# Altium project DHS.PrjPcb
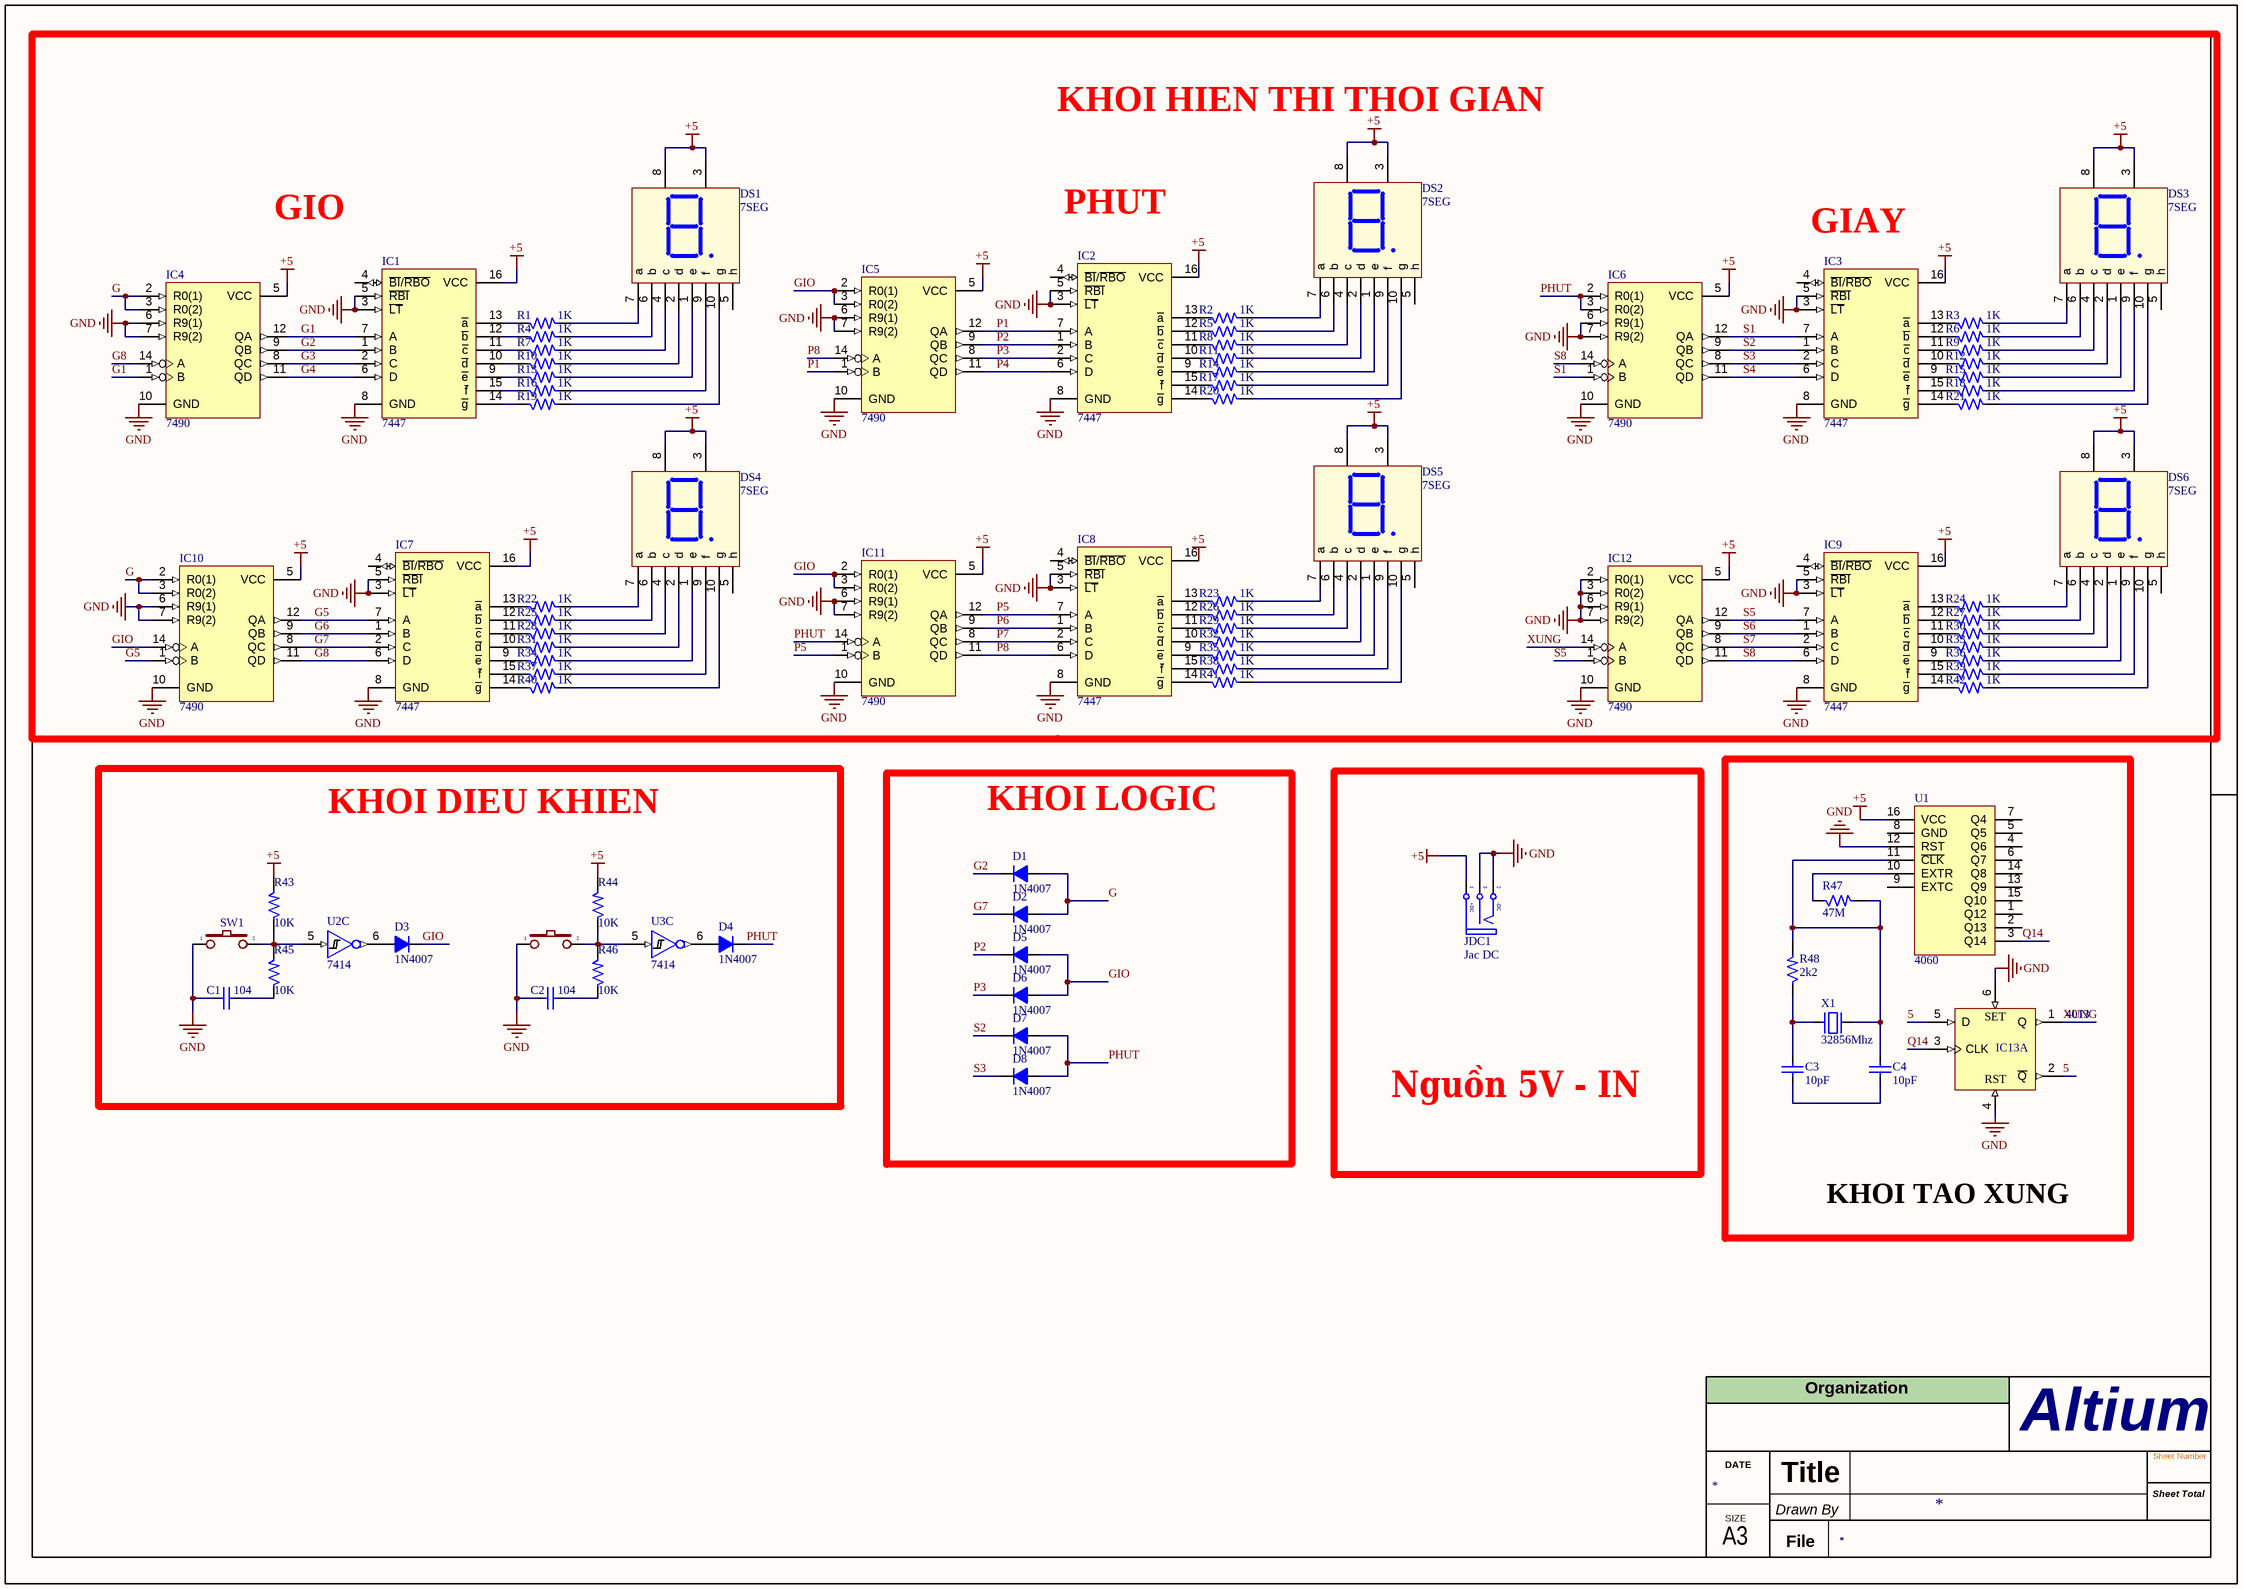
[diagram p0: DHS.SchDoc]
1 sheet, 86 parts. Net scope: global (net labels, ports and power ports of the same name join across sheets).
Board file: PCB1.PcbDoc

## Sheet DHS.SchDoc
size 420 x 297 mm; SheetNumber: 1; SheetTotal: 1

### Parts
C1  104  [Cap 2.54mm]
C2  104  [Cap 2.54mm]
C3  10pF  [Cap 7.5mm]
C4  10pF  [Cap 7.5mm]
D1  1N4007  [D2A]
D2  1N4007  [D2A]
D3  1N4007  [DO-41]
D4  1N4007  [DO-41]
D5  1N4007  [D2A]
D6  1N4007  [D2A]
D7  1N4007  [D2A]
D8  1N4007  [D2A]
DS1  7SEG  [LED7SEG-1-0.56]
DS2  7SEG  [LED7SEG-1-0.56]
DS3  7SEG  [LED7SEG-1-0.56]
DS4  7SEG  [LED7SEG-1-0.56]
DS5  7SEG  [LED7SEG-1-0.56]
DS6  7SEG  [LED7SEG-1-0.56]
IC1  7447  [DIP16]
IC2  7447  [DIP16]
IC3  7447  [DIP16]
IC4  7490  [DIP14]
IC5  7490  [DIP14]
IC6  7490  [DIP14]
IC7  7447  [DIP16]
IC8  7447  [DIP16]
IC9  7447  [DIP16]
IC10  7490  [DIP14]
IC11  7490  [DIP14]
IC12  7490  [DIP14]
IC13  4013  [DIP14]  (part A of 2)
JDC1  Jac DC  [DC0]
R1  1K  [RES-1/4W]
R2  1K  [RES-1/4W]
R3  1K  [RES-1/4W]
R4  1K  [RES-1/4W]
R5  1K  [RES-1/4W]
R6  1K  [RES-1/4W]
R7  1K  [RES-1/4W]
R8  1K  [RES-1/4W]
R9  1K  [RES-1/4W]
R10  1K  [RES-1/4W]
R11  1K  [RES-1/4W]
R12  1K  [RES-1/4W]
R13  1K  [RES-1/4W]
R14  1K  [RES-1/4W]
R15  1K  [RES-1/4W]
R16  1K  [RES-1/4W]
R17  1K  [RES-1/4W]
R18  1K  [RES-1/4W]
R19  1K  [RES-1/4W]
R20  1K  [RES-1/4W]
R21  1K  [RES-1/4W]
R22  1K  [RES-1/4W]
R23  1K  [RES-1/4W]
R24  1K  [RES-1/4W]
R25  1K  [RES-1/4W]
R26  1K  [RES-1/4W]
R27  1K  [RES-1/4W]
R28  1K  [RES-1/4W]
R29  1K  [RES-1/4W]
R30  1K  [RES-1/4W]
R31  1K  [RES-1/4W]
R32  1K  [RES-1/4W]
R33  1K  [RES-1/4W]
R34  1K  [RES-1/4W]
R35  1K  [RES-1/4W]
R36  1K  [RES-1/4W]
R37  1K  [RES-1/4W]
R38  1K  [RES-1/4W]
R39  1K  [RES-1/4W]
R40  1K  [RES-1/4W]
R41  1K  [RES-1/4W]
R42  1K  [RES-1/4W]
R43  10K  [RES-1/4W]
R44  10K  [RES-1/4W]
R45  10K  [RES-1/4W]
R46  10K  [RES-1/4W]
R47  47M  [RES-1/4W]
R48  2k2  [RES-1/4W]
SW1  SW  [SW2 6x6MM Circle]  (value not drawn)
SW2  SW  [SW2 6x6MM Circle]  (value not drawn)
U1  4060  [DIP16]
U2  7414  [DIP14]  (part C of 7)
U3  7414  [DIP14]  (part C of 7)
X1  32856Mhz  [XT2]

### Blocks framed on the sheet
Nguồn 5V - IN: JDC1
KHOI TAO XUNG: C3 C4 IC13 R47 R48 U1 X1

### Nets
+5: DS1.3(Vcc) DS1.8(Vcc) DS2.3(Vcc) DS2.8(Vcc) DS3.3(Vcc) DS3.8(Vcc) DS4.3(Vcc) DS4.8(Vcc) DS5.3(Vcc) DS5.8(Vcc) DS6.3(Vcc) DS6.8(Vcc) IC1.16(VCC) IC2.16(VCC) IC3.16(VCC) IC4.5(VCC) IC5.5(VCC) IC6.5(VCC) IC7.16(VCC) IC8.16(VCC) IC9.16(VCC) IC10.5(VCC) IC11.5(VCC) IC12.5(VCC) JDC1.1(T) R43.2 R44.2 U1.16(VCC)
GND: C1.2 C2.2 IC1.3(~{LT}) IC1.5(~{RBI}) IC1.8(GND) IC2.3(~{LT}) IC2.5(~{RBI}) IC2.8(GND) IC3.3(~{LT}) IC3.5(~{RBI}) IC3.8(GND) IC4.6(R9(1)) IC4.7(R9(2)) IC4.10(GND) IC5.6(R9(1)) IC5.7(R9(2)) IC5.10(GND) IC6.6(R9(1)) IC6.7(R9(2)) IC6.10(GND) IC7.3(~{LT}) IC7.5(~{RBI}) IC7.8(GND) IC8.3(~{LT}) IC8.5(~{RBI}) IC8.8(GND) IC9.3(~{LT}) IC9.5(~{RBI}) IC9.8(GND) IC10.6(R9(1)) IC10.7(R9(2)) IC10.10(GND) IC11.6(R9(1)) IC11.7(R9(2)) IC11.10(GND) IC12.2(R0(1)) IC12.3(R0(2)) IC12.6(R9(1)) IC12.7(R9(2)) IC12.10(GND) IC13.4(RST) IC13.6(S) IC13.7(GND) JDC1.2(TN) JDC1.3(S) SW1.1 SW2.1 U1.12(RST)
VDD: IC13.14(VDD)
5: IC13.2(~{Q}) IC13.5(D)
G: D1.1(A) D2.1(A) IC4.2(R0(1)) IC4.3(R0(2)) IC10.2(R0(1)) IC10.3(R0(2))
G1: IC1.7(A) IC4.1(B) IC4.12(QA)
G2: D1.2(K) IC1.1(B) IC4.9(QB)
G3: IC1.2(C) IC4.8(QC)
G4: IC1.6(D) IC4.11(QD)
G5: IC7.7(A) IC10.1(B) IC10.12(QA)
G6: IC7.1(B) IC10.9(QB)
G7: D2.2(K) IC7.2(C) IC10.8(QC)
G8: IC4.14(A) IC7.6(D) IC10.11(QD)
GIO: D3.2(K) D5.1(A) D6.1(A) IC5.2(R0(1)) IC5.3(R0(2)) IC10.14(A) IC11.2(R0(1)) IC11.3(R0(2))
P1: IC2.7(A) IC5.1(B) IC5.12(QA)
P2: D5.2(K) IC2.1(B) IC5.9(QB)
P3: D6.2(K) IC2.2(C) IC5.8(QC)
P4: IC2.6(D) IC5.11(QD)
P5: IC8.7(A) IC11.1(B) IC11.12(QA)
P6: IC8.1(B) IC11.9(QB)
P7: IC8.2(C) IC11.8(QC)
P8: IC5.14(A) IC8.6(D) IC11.11(QD)
PHUT: D4.2(K) D7.1(A) D8.1(A) IC6.2(R0(1)) IC6.3(R0(2)) IC11.14(A)
Q14: IC13.3(CLK) U1.3(Q14)
S1: IC3.7(A) IC6.1(B) IC6.12(QA)
S2: D7.2(K) IC3.1(B) IC6.9(QB)
S3: D8.2(K) IC3.2(C) IC6.8(QC)
S4: IC3.6(D) IC6.11(QD)
S5: IC9.7(A) IC12.1(B) IC12.12(QA)
S6: IC9.1(B) IC12.9(QB)
S7: IC9.2(C) IC12.8(QC)
S8: IC6.14(A) IC9.6(D) IC12.11(QD)
XUNG: IC12.14(A) IC13.1(Q)
NetC1_1: C1.1 R45.1
NetC2_1: C2.1 R46.1
NetC3_1: C3.1 C4.2
NetC3_2: C3.2 R48.1 X1.1
NetC4_1: C4.1 R47.2 R48.2 U1.11(~{CLK}) X1.2
NetD3_1: D3.1(A) U2.6(Y)
NetD4_1: D4.1(A) U3.6(Y)
NetDS1_1: DS1.1(e) R13.2
NetDS1_2: DS1.2(d) R10.2
NetDS1_4: DS1.4(c) R7.2
NetDS1_6: DS1.6(b) R4.2
NetDS1_7: DS1.7(a) R1.2
NetDS1_9: DS1.9(f) R16.2
NetDS1_10: DS1.10(g) R19.2
NetDS2_1: DS2.1(e) R14.2
NetDS2_2: DS2.2(d) R11.2
NetDS2_4: DS2.4(c) R8.2
NetDS2_6: DS2.6(b) R5.2
NetDS2_7: DS2.7(a) R2.2
NetDS2_9: DS2.9(f) R17.2
NetDS2_10: DS2.10(g) R20.2
NetDS3_1: DS3.1(e) R15.2
NetDS3_2: DS3.2(d) R12.2
NetDS3_4: DS3.4(c) R9.2
NetDS3_6: DS3.6(b) R6.2
NetDS3_7: DS3.7(a) R3.2
NetDS3_9: DS3.9(f) R18.2
NetDS3_10: DS3.10(g) R21.2
NetDS4_1: DS4.1(e) R34.2
NetDS4_2: DS4.2(d) R31.2
NetDS4_4: DS4.4(c) R28.2
NetDS4_6: DS4.6(b) R25.2
NetDS4_7: DS4.7(a) R22.2
NetDS4_9: DS4.9(f) R37.2
NetDS4_10: DS4.10(g) R40.2
NetDS5_1: DS5.1(e) R35.2
NetDS5_2: DS5.2(d) R32.2
NetDS5_4: DS5.4(c) R29.2
NetDS5_6: DS5.6(b) R26.2
NetDS5_7: DS5.7(a) R23.2
NetDS5_9: DS5.9(f) R38.2
NetDS5_10: DS5.10(g) R41.2
NetDS6_1: DS6.1(e) R36.2
NetDS6_2: DS6.2(d) R33.2
NetDS6_4: DS6.4(c) R30.2
NetDS6_6: DS6.6(b) R27.2
NetDS6_7: DS6.7(a) R24.2
NetDS6_9: DS6.9(f) R39.2
NetDS6_10: DS6.10(g) R42.2
NetIC1_9: IC1.9(~{e}) R13.1
NetIC1_10: IC1.10(~{d}) R10.1
NetIC1_11: IC1.11(~{c}) R7.1
NetIC1_12: IC1.12(~{b}) R4.1
NetIC1_13: IC1.13(~{a}) R1.1
NetIC1_14: IC1.14(~{g}) R19.1
NetIC1_15: IC1.15(~{f}) R16.1
NetIC2_9: IC2.9(~{e}) R14.1
NetIC2_10: IC2.10(~{d}) R11.1
NetIC2_11: IC2.11(~{c}) R8.1
NetIC2_12: IC2.12(~{b}) R5.1
NetIC2_13: IC2.13(~{a}) R2.1
NetIC2_14: IC2.14(~{g}) R20.1
NetIC2_15: IC2.15(~{f}) R17.1
NetIC3_9: IC3.9(~{e}) R15.1
NetIC3_10: IC3.10(~{d}) R12.1
NetIC3_11: IC3.11(~{c}) R9.1
NetIC3_12: IC3.12(~{b}) R6.1
NetIC3_13: IC3.13(~{a}) R3.1
NetIC3_14: IC3.14(~{g}) R21.1
NetIC3_15: IC3.15(~{f}) R18.1
NetIC7_9: IC7.9(~{e}) R34.1
NetIC7_10: IC7.10(~{d}) R31.1
NetIC7_11: IC7.11(~{c}) R28.1
NetIC7_12: IC7.12(~{b}) R25.1
NetIC7_13: IC7.13(~{a}) R22.1
NetIC7_14: IC7.14(~{g}) R40.1
NetIC7_15: IC7.15(~{f}) R37.1
NetIC8_9: IC8.9(~{e}) R35.1
NetIC8_10: IC8.10(~{d}) R32.1
NetIC8_11: IC8.11(~{c}) R29.1
NetIC8_12: IC8.12(~{b}) R26.1
NetIC8_13: IC8.13(~{a}) R23.1
NetIC8_14: IC8.14(~{g}) R41.1
NetIC8_15: IC8.15(~{f}) R38.1
NetIC9_9: IC9.9(~{e}) R36.1
NetIC9_10: IC9.10(~{d}) R33.1
NetIC9_11: IC9.11(~{c}) R30.1
NetIC9_12: IC9.12(~{b}) R27.1
NetIC9_13: IC9.13(~{a}) R24.1
NetIC9_14: IC9.14(~{g}) R42.1
NetIC9_15: IC9.15(~{f}) R39.1
NetR43_1: R43.1 R45.2 SW1.2 U2.5(A)
NetR44_1: R44.1 R46.2 SW2.2 U3.5(A)
NetR47_1: R47.1 U1.10(EXTR)

Not connected (* = marked no-connect by the designer): DS1 5(h); DS2 5(h); DS3 5(h); DS4 5(h); DS5 5(h); DS6 5(h); IC1 4(~{BI}/~{RBO}); IC2 4(~{BI}/~{RBO}); IC3 4(~{BI}/~{RBO}); IC7 4(~{BI}/~{RBO}); IC8 4(~{BI}/~{RBO}); IC9 4(~{BI}/~{RBO}); U1 1(Q12) 2(Q13) 4(Q6) 5(Q5) 6(Q7) 7(Q4) 8(GND) 9(EXTC) 13(Q9) 14(Q8) 15(Q10)

### Notes on the sheet
- KHOI HIEN THI THOI GIAN
- GIO
- PHUT
- (near IC3) GIAY
- KHOI DIEU KHIEN
- KHOI LOGIC
- Organization
- DATE
- Title
- Altium
- Sheet Number
- SIZE
- Drawn By
- File
- Sheet Total
- A3
- (in symbol 4013, part A) SET
- (in symbol DCIN) +DC; -DC

### Library data of the parts
C1-C4 = CN: Capacitor
D1 D2 D5-D8 = D1A: Diode 1A; Value: 1N4007
D3 D4 = Diode 1A: Diode 1A 1N4007 DO-41
DS1-DS6 = LED7SEG-1: 14.2 mm General Purpose Blue 7-Segment Display: CC, RH DP, Gray Surface; MinimumIntensity: 2020 ucd; Note: IF = 10 mA; Published: 8-Jun-2000; LatestRevisionDate: 17-Dec-2003; LatestRevisionNote: Schematic revised, PCB Footprint replaced.; DatasheetDocument: 24-Sep-2002; PackageDocument: 24-Sep-2002; PackageReference: H; Publisher: Altium Limited; Colour: Blue; ComponentLink1Description: Manufacturer Link; ComponentLink1URL: http://www.agilent.com/
IC1-IC3 IC7-IC9 = 7447: BCD to 7-Segment Decoder/Driver; Value: 7447 , 74247
IC4-IC6 IC10-IC12 = 7490: 4-Bit Decade Counter; Value: 7490
IC13 = 4013: Dual D-Type Flip-Flop; Creat by: VanDungEvn@Gmail.com
JDC1 = DCIN: Jac DC input; Value: Jac DC
R1-R48 = Res
SW1 SW2 = SW2: Switch button 2 pin; Value: SW chip 2 pin
U2 U3 = 7414: IC, M74HC04M, Hex Inverter, SO-14; Text Field1: ST; Text Field2: M74HC04M1R; Text Field3: Mouser; Text Field4: 511-M74HC04M; Text Field6: .22; Text Field5: SO-14; NI?: *; O?: *; Section:: *
X1 = XT2: Crystal, 32.768 KHz, -40 to 85 degC, 3.2 x 1.5 x 0.9 mm SMD; Value: 4Mhz